# Altium schematic sheet POWR0003_Tray3v1.SchDoc: Tray 3 High Level Power Layout
size A3; Engineer: C. BROWN; Organization: BLUEsat Project; Address1: Room 419; Address2: School of EE&T; Address3: UNSW, NSW 2052; Address4: Australia; DocumentNumber: POWR003; SheetNumber: 1; SheetTotal: 1; Description: Architectural illustration for power distribution devices; Version: 1.0
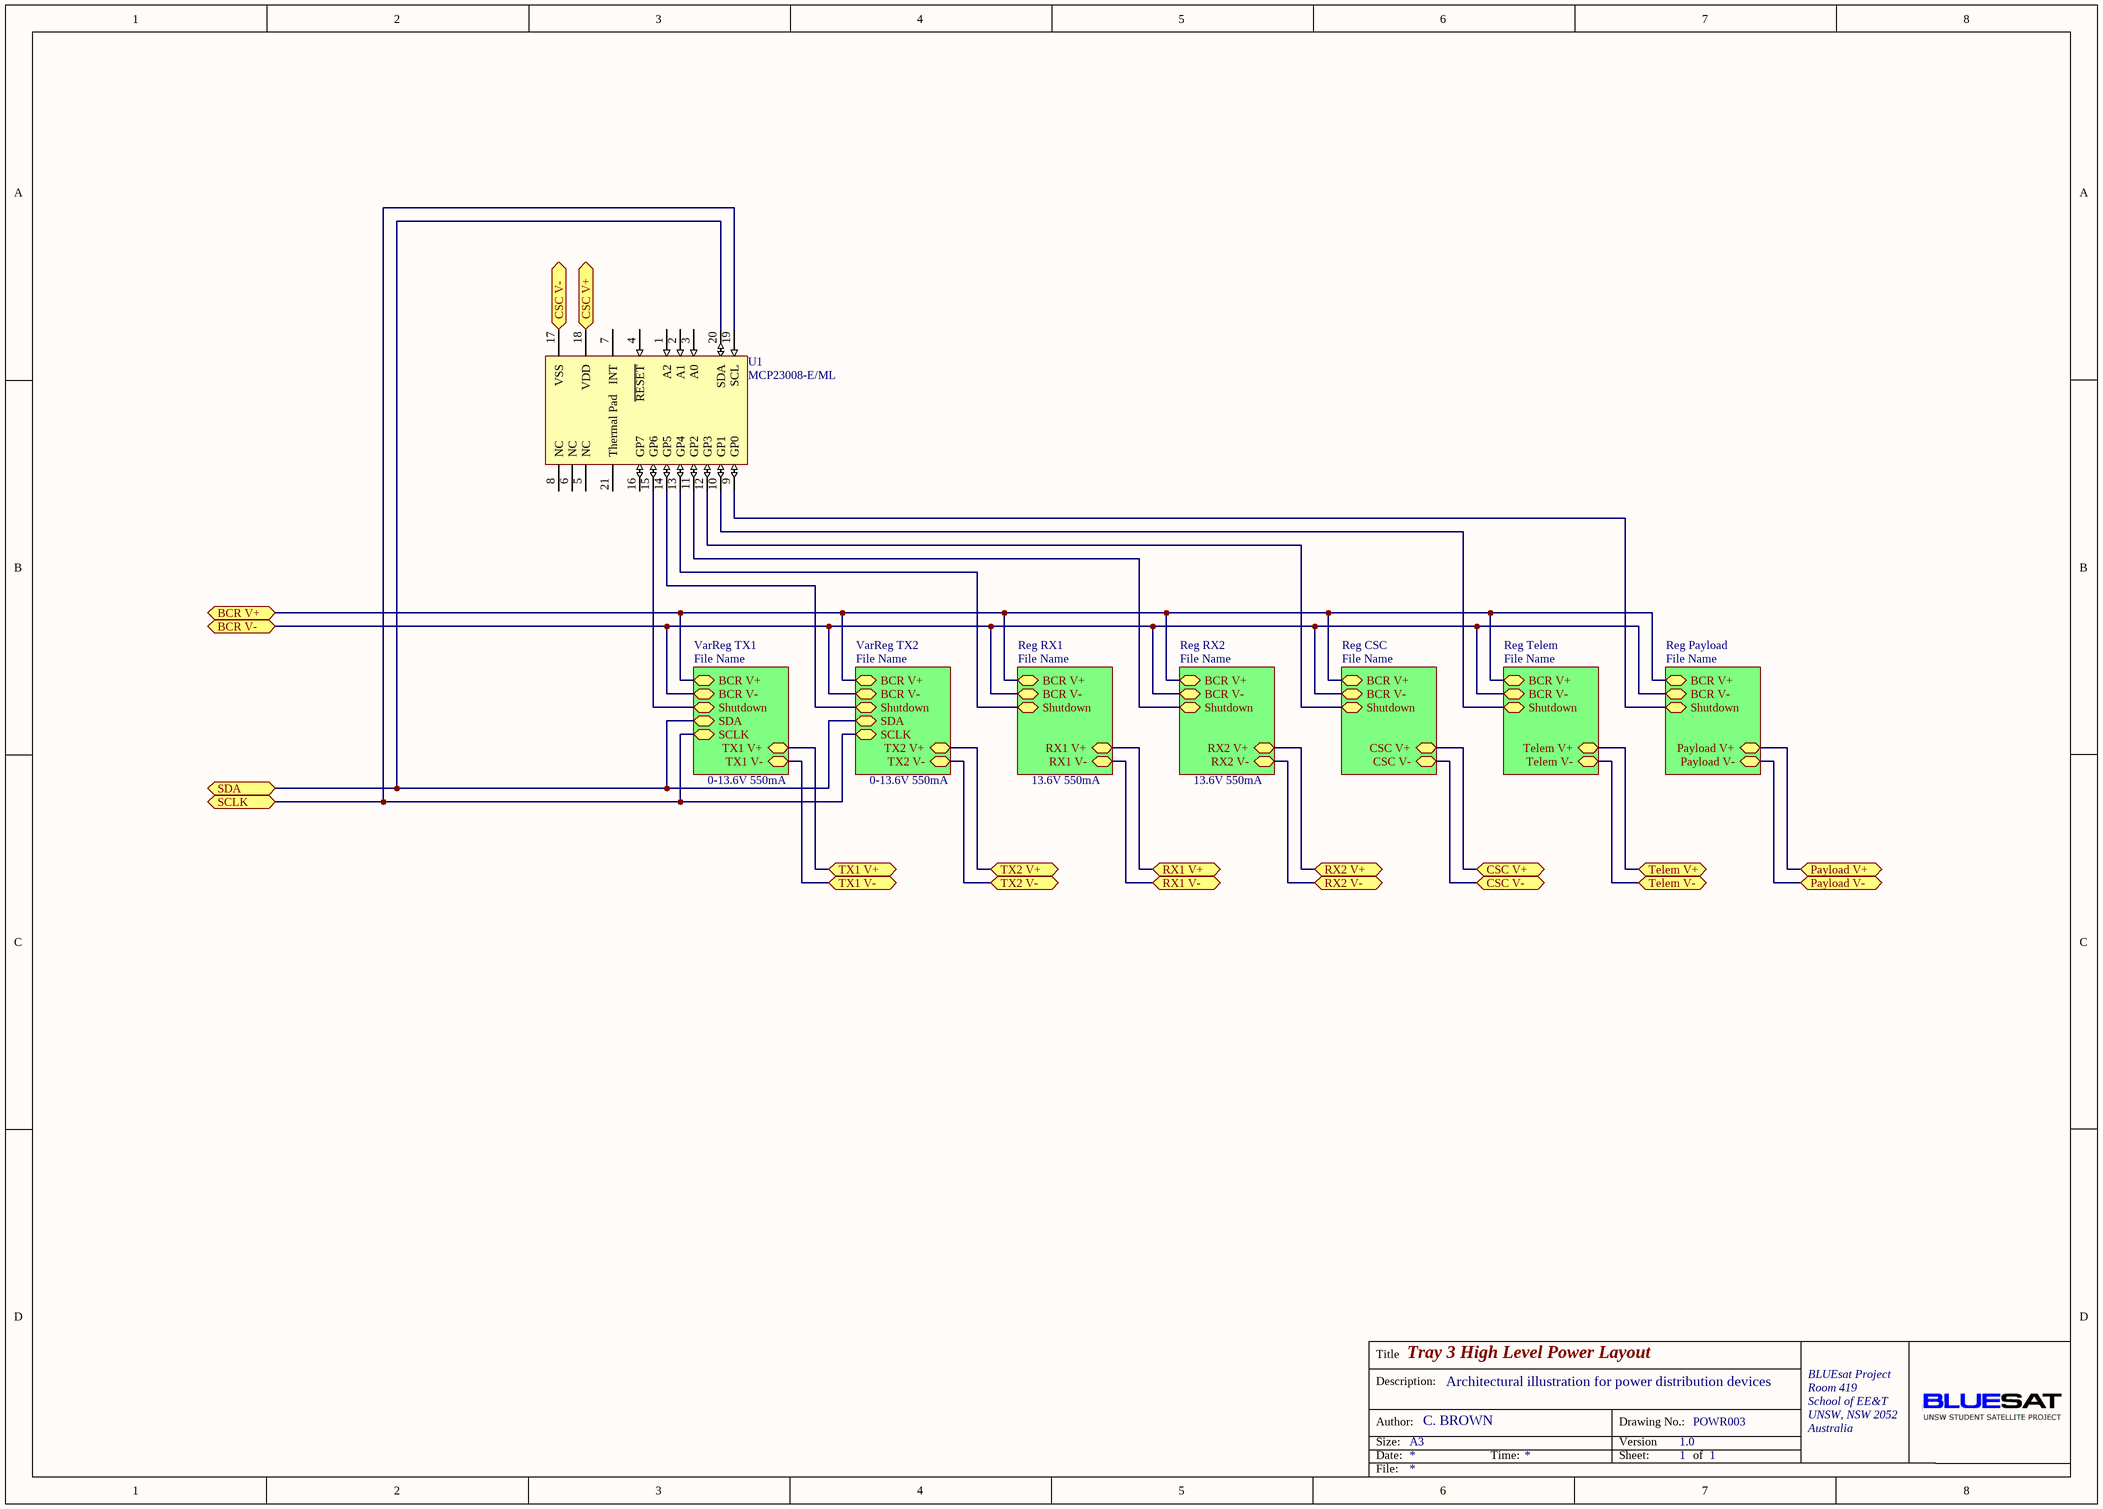
[diagram p0: POWR0003_Tray3v1.SchDoc]

## Parts
U1  MCP23008-E/ML  [QFN-ML20_N]

## Sub-sheets
Reg CSC = File Name: BCR V+, BCR V-, Shutdown, CSC V-, CSC V+
Reg Payload = File Name: BCR V+, BCR V-, Shutdown, Payload V-, Payload V+
Reg RX1 = File Name: BCR V+, BCR V-, Shutdown, RX1 V-, RX1 V+
Reg RX2 = File Name: BCR V+, BCR V-, Shutdown, RX2 V-, RX2 V+
Reg Telem = File Name: BCR V+, BCR V-, Shutdown, Telem V-, Telem V+
VarReg TX1 = File Name: BCR V+, BCR V-, Shutdown, SDA, SCLK, TX1 V-, TX1 V+
VarReg TX2 = File Name: BCR V+, BCR V-, Shutdown, SDA, SCLK, TX2 V-, TX2 V+

## Ports
BCR V+, BCR V-, CSC V+, CSC V-, Payload V+, Payload V-, RX1 V+, RX1 V-, RX2 V+, RX2 V-, SCLK, SDA, Telem V+, Telem V-, TX1 V+, TX1 V-, TX2 V+, TX2 V-

## Nets
BCR V+: port BCR V+, sheet VarReg TX1/BCR V+, sheet Reg Telem/BCR V+, sheet VarReg TX2/BCR V+, sheet Reg RX1/BCR V+, sheet Reg RX2/BCR V+, sheet Reg CSC/BCR V+, sheet Reg Payload/BCR V+
BCR V-: port BCR V-, sheet VarReg TX1/BCR V-, sheet Reg Telem/BCR V-, sheet VarReg TX2/BCR V-, sheet Reg RX1/BCR V-, sheet Reg RX2/BCR V-, sheet Reg CSC/BCR V-, sheet Reg Payload/BCR V-
CSC V+: U1.18(VDD) ; port CSC V+, sheet Reg CSC/CSC V+
CSC V-: U1.17(VSS) ; port CSC V-, sheet Reg CSC/CSC V-
Payload V+: port Payload V+, sheet Reg Payload/Payload V+
Payload V-: port Payload V-, sheet Reg Payload/Payload V-
RX1 V+: port RX1 V+, sheet Reg RX1/RX1 V+
RX1 V-: port RX1 V-, sheet Reg RX1/RX1 V-
RX2 V+: port RX2 V+, sheet Reg RX2/RX2 V+
RX2 V-: port RX2 V-, sheet Reg RX2/RX2 V-
SCLK: U1.19(SCL) ; port SCLK, sheet VarReg TX1/SCLK, sheet VarReg TX2/SCLK
SDA: U1.20(SDA) ; port SDA, sheet VarReg TX1/SDA, sheet VarReg TX2/SDA
Telem V+: port Telem V+, sheet Reg Telem/Telem V+
Telem V-: port Telem V-, sheet Reg Telem/Telem V-
TX1 V+: port TX1 V+, sheet VarReg TX1/TX1 V+
TX1 V-: port TX1 V-, sheet VarReg TX1/TX1 V-
TX2 V+: port TX2 V+, sheet VarReg TX2/TX2 V+
TX2 V-: port TX2 V-, sheet VarReg TX2/TX2 V-
NetU1_9: U1.9(GP0) ; sheet Reg Payload/Shutdown
NetU1_10: U1.10(GP1) ; sheet Reg Telem/Shutdown
NetU1_11: U1.11(GP2) ; sheet Reg RX2/Shutdown
NetU1_12: U1.12(GP3) ; sheet Reg CSC/Shutdown
NetU1_13: U1.13(GP4) ; sheet Reg RX1/Shutdown
NetU1_14: U1.14(GP5) ; sheet VarReg TX2/Shutdown
NetU1_15: U1.15(GP6) ; sheet VarReg TX1/Shutdown

Not connected (* = marked no-connect by the designer): U1 1(A2) 2(A1) 3(A0) 4(~{RESET}) 5(NC) 6(NC) 7(INT) 8(NC) 16(GP7) 21(Thermal_Pad)

## Notes on the sheet
- 0-13.6V 550mA
- 13.6V 550mA
- Title
- Description:
- Size:
- Author:
- Date:
- A3
- Time:
- Version
- Sheet:
- Drawing No.:
- of
- File:

## Library data of the parts
U1 = MCP23008-E/ML: 8-Bit I/O Expander with Serial Interface, 20-Pin QFN, Extended Temperature; Published: 29-Jan-2009; DatasheetVersion: revE, Aug-2007; PackageVersion: revAW, Oct-2008; PackageReference: QFN-ML20; Publisher: Altium Limited; PackageDescription: 20-Lead Plastic Quad Flat, No Lead Package (ML) - 4x4x0.9 mm Body [QFN]; ComponentLink1Description: Manufacturer Link; ComponentLink1URL: http://www.microchip.com; ComponentLink2Description: Datasheet; ComponentLink2URL: http://ww1.microchip.com/downloads/en/DeviceDoc/21919e.pdf; ComponentLink3Description: Packaging Specification; ComponentLink3URL: http://ww1.microchip.com/downloads/en/PackagingSpec/00049AW.pdf